# EasyEDA schematic 500V50A三相全桥板.json
TITLE: Sheet_1; REV: 1.0; Date: 2026-07-11; Sheet: 1/1; Drawn By: siberia-09; Company: Your Company
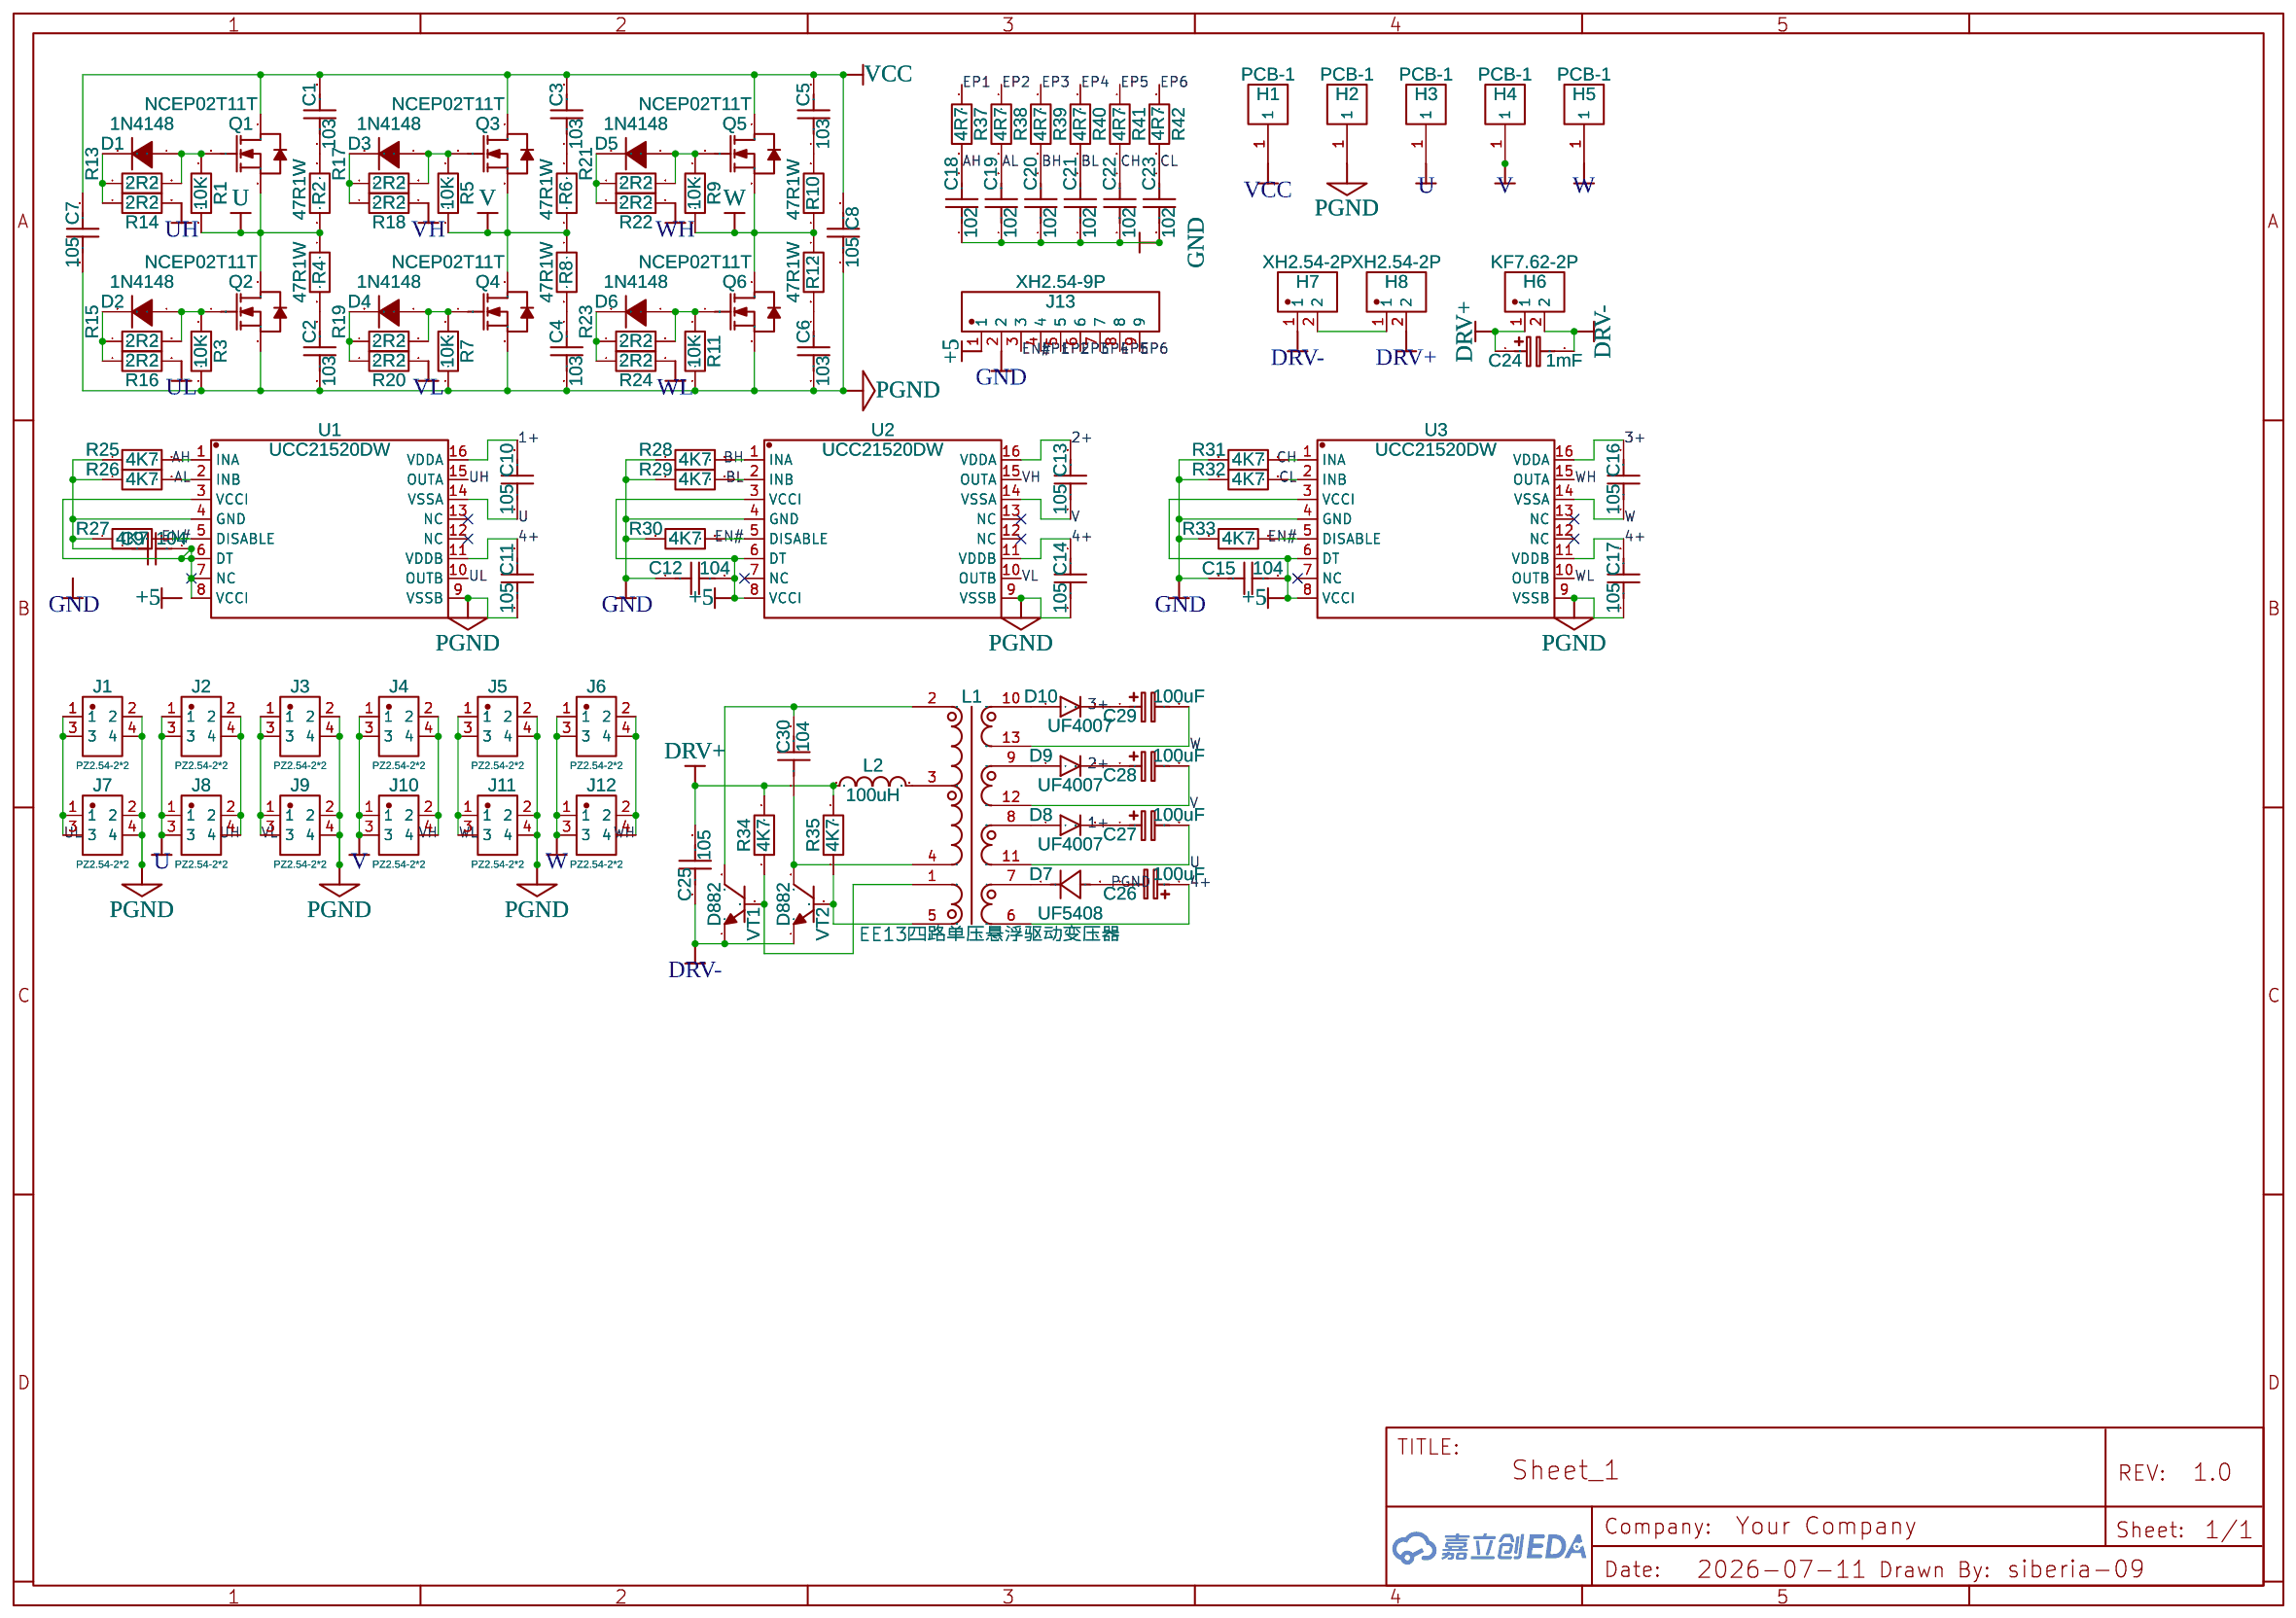
[diagram p0: schematic sheet]

## Parts
C1  103  [RAD-0.3]
C2  103  [RAD-0.3]
C3  103  [RAD-0.3]
C4  103  [RAD-0.3]
C5  103  [RAD-0.3]
C6  103  [RAD-0.3]
C7  105  [26*8 MKP]
C8  105  [26*8 MKP]
C9  104  [RAD-0.2]
C10  105  [RAD-0.2]
C11  105  [RAD-0.2]
C12  104  [RAD-0.2]
C13  105  [RAD-0.2]
C14  105  [RAD-0.2]
C15  104  [RAD-0.2]
C16  105  [RAD-0.2]
C17  105  [RAD-0.2]
C18  102  [RAD-0.2]
C19  102  [RAD-0.2]
C20  102  [RAD-0.2]
C21  102  [RAD-0.2]
C22  102  [RAD-0.2]
C23  102  [RAD-0.2]
C24  1mF  [CAP-10*25-W-2]
C25  105  [RAD-0.2]
C26  100uF  [CAP-6.3*11]
C27  100uF  [CAP-6.3*11]
C28  100uF  [CAP-6.3*11]
C29  100uF  [CAP-6.3*11]
C30  104  [RAD-0.2]
D1  1N4148  [SOD-323]
D2  1N4148  [SOD-323]
D3  1N4148  [SOD-323]
D4  1N4148  [SOD-323]
D5  1N4148  [SOD-323]
D6  1N4148  [SOD-323]
D7  UF5408  [DO-27]
D8  UF4007  [DO-41_BD2.4-L4.7-P8.70-D0.9-FD]
D9  UF4007  [DO-41_BD2.4-L4.7-P8.70-D0.9-FD]
D10  UF4007  [DO-41_BD2.4-L4.7-P8.70-D0.9-FD]
H1  PCB-1  [PCB-1 35A]
H2  PCB-1  [PCB-1 35A]
H3  PCB-1  [PCB-1 35A]
H4  PCB-1  [PCB-1 35A]
H5  PCB-1  [PCB-1 35A]
H6  KF7.62-2P  [CONN-TH_KF7.62-2P]
H7  XH2.54-2P  [CONN-TH_XH2.54-2P_1]
H8  XH2.54-2P  [CONN-TH_XH2.54-2P_1]
J1  PZ2.54-2*2  [HDR-TH_4P-P2.54-V-M-R2-C2-S2.54]
J2  PZ2.54-2*2  [HDR-TH_4P-P2.54-V-M-R2-C2-S2.54]
J3  PZ2.54-2*2  [HDR-TH_4P-P2.54-V-M-R2-C2-S2.54]
J4  PZ2.54-2*2  [HDR-TH_4P-P2.54-V-M-R2-C2-S2.54]
J5  PZ2.54-2*2  [HDR-TH_4P-P2.54-V-M-R2-C2-S2.54]
J6  PZ2.54-2*2  [HDR-TH_4P-P2.54-V-M-R2-C2-S2.54]
J7  PZ2.54-2*2  [HDR-TH_4P-P2.54-V-M-R2-C2-S2.54]
J8  PZ2.54-2*2  [HDR-TH_4P-P2.54-V-M-R2-C2-S2.54]
J9  PZ2.54-2*2  [HDR-TH_4P-P2.54-V-M-R2-C2-S2.54]
J10  PZ2.54-2*2  [HDR-TH_4P-P2.54-V-M-R2-C2-S2.54]
J11  PZ2.54-2*2  [HDR-TH_4P-P2.54-V-M-R2-C2-S2.54]
J12  PZ2.54-2*2  [HDR-TH_4P-P2.54-V-M-R2-C2-S2.54]
J13  XH2.54-9P  [CONN-TH_9P-P2.50_BX-XH2.54-9PZZ]
L1  EE13四路单压悬浮驱动变压器  [EE13单压四路悬浮驱动变压器]
L2  100uH  [L 15*7MM]
Q1  NCEP02T11T  [TO-247-3_L15.5-W5.0-P5.08-L]
Q2  NCEP02T11T  [TO-247-3_L15.5-W5.0-P5.08-L]
Q3  NCEP02T11T  [TO-247-3_L15.5-W5.0-P5.08-L]
Q4  NCEP02T11T  [TO-247-3_L15.5-W5.0-P5.08-L]
Q5  NCEP02T11T  [TO-247-3_L15.5-W5.0-P5.08-L]
Q6  NCEP02T11T  [TO-247-3_L15.5-W5.0-P5.08-L]
R1  10K  [R_AXIAL-0.4]
R2  47R1W  [R_AXIAL-0.4]
R3  10K  [R_AXIAL-0.4]
R4  47R1W  [R_AXIAL-0.4]
R5  10K  [R_AXIAL-0.4]
R6  47R1W  [R_AXIAL-0.4]
R7  10K  [R_AXIAL-0.4]
R8  47R1W  [R_AXIAL-0.4]
R9  10K  [R_AXIAL-0.4]
R10  47R1W  [R_AXIAL-0.4]
R11  10K  [R_AXIAL-0.4]
R12  47R1W  [R_AXIAL-0.4]
R13  2R2  [0805]
R14  2R2  [0805]
R15  2R2  [0805]
R16  2R2  [0805]
R17  2R2  [0805]
R18  2R2  [0805]
R19  2R2  [0805]
R20  2R2  [0805]
R21  2R2  [0805]
R22  2R2  [0805]
R23  2R2  [0805]
R24  2R2  [0805]
R25  4K7  [R_AXIAL-0.4]
R26  4K7  [R_AXIAL-0.4]
R27  4K7  [R VERTICAL 1/4W]
R28  4K7  [R_AXIAL-0.4]
R29  4K7  [R_AXIAL-0.4]
R30  4K7  [R VERTICAL 1/4W]
R31  4K7  [R_AXIAL-0.4]
R32  4K7  [R_AXIAL-0.4]
R33  4K7  [R VERTICAL 1/4W]
R34  4K7  [R VERTICAL 1/4W]
R35  4K7  [R VERTICAL 1/4W]
R37  4R7  [R VERTICAL 1/4W]
R38  4R7  [R VERTICAL 1/4W]
R39  4R7  [R VERTICAL 1/4W]
R40  4R7  [R VERTICAL 1/4W]
R41  4R7  [R VERTICAL 1/4W]
R42  4R7  [R VERTICAL 1/4W]
U1  UCC21520DW  [SOIC-16_L10.3-W7.5-P1.27-LS10.3-BL]
U2  UCC21520DW  [SOIC-16_L10.3-W7.5-P1.27-LS10.3-BL]
U3  UCC21520DW  [SOIC-16_L10.3-W7.5-P1.27-LS10.3-BL]
VT1  D882  [TO-126P-3_L7.5-W2.6-P2.29-L-A]
VT2  D882  [TO-126P-3_L7.5-W2.6-P2.29-L-A]

## Library data of the parts
C1-C23 C25 C30 = C_RAD-0.3_US: Contributor: LCEDA_Lib
C24 C26-C29 = C_Tan_SMD_A_EU: Contributor: LCEDA_Lib
D1-D6 = 1N4148: Supplier: LCSC; Manufacturer: ST(先科); Supplier Part: C14516; JLCPCB Part Class: Extended Part
D7 = UF5408_C2903841: Contributor: lcsc; Supplier: LCSC; Supplier Part: C2903841; Manufacturer: LGE(鲁光); JLCPCB Part Class: Extended Part
D8-D10 = UF4007_C84067: Contributor: 立创EDA官方封装库; Supplier: LCSC; Manufacturer: 星海; Supplier Part: C84067; JLCPCB Part Class: Extended Part
H1-H5 = PCB-5M5-100A: Contributor: SuperWoo
H6 = KF7.62-2P: Contributor: LCSC; Supplier: LCSC; Supplier Part: C707824; Manufacturer: KEFA(科发); JLCPCB Part Class: Extended Part
H7 H8 = WAFER-XH2.54-2PZZ: Contributor: lcsc; Supplier: LCSC; Supplier Part: C5359631; Manufacturer: XUNPU(讯普); JLCPCB Part Class: Extended Part
J1-J12 = PZ2.54-2*2: Contributor: lcsc; Supplier: LCSC; Supplier Part: C5156675; Manufacturer: ZHOURI(洲日); JLCPCB Part Class: Extended Part
J13 = BX-XH2.54-9PZZ: Supplier: LCSC; Supplier Part: C18077840; Manufacturer: Bossie(博锡); Contributor: lcsc; JLCPCB Part Class: Extended Part
L1 = EE13四路单压悬浮驱动变压器: Contributor: siberia-09
L2 = L0603_US: Contributor: LCEDA_Lib
Q1-Q6 = IRFP260N: Supplier: LCSC; Supplier Part: C33129608; Manufacturer: minos(迈诺斯); Contributor: lcsc; JLCPCB Part Class: Extended Part
R1-R12 R34 R35 R37-R42 = R_AXIAL-0.3_EU: Contributor: LCEDA_Lib
R13-R33 = R_AXIAL-0.4_EU: Contributor: LCEDA_Lib
U1-U3 = UCC21520DW: Contributor: LCSC; Supplier: LCSC; Supplier Part: C200361; Manufacturer: TI(德州仪器); JLCPCB Part Class: Extended Part
VT1 VT2 = D882P: Supplier: LCSC; Supplier Part: C9900159908; Manufacturer: null; Contributor: lcsc

## Nets
GND: C12.1 C15.1 C18.1 C19.1 C20.1 C21.1 C22.2 C23.2 J13.2 R28.1 R29.1 R30.1 R31.1 R32.1 R33.1 U2.4(GND) U3.4(GND)
PGND: C2.2 C4.2 C6.2 C7.1 C8.1 C11.1 C14.1 C17.1 C26.2 D7.2(A) H2.1 J1.2 J1.4 J3.2 J3.4 J5.2 J5.4 J7.2 J7.4 J9.2 J9.4 J11.2 J11.4 Q2.3(S) Q4.3(S) Q6.3(S) R3.1 R7.1 R11.1 U1.9(VSSB) U2.9(VSSB) U3.9(VSSB)
VCC: C1.2 C3.2 C5.2 C7.2 C8.2 H1.1 Q1.2(D) Q3.2(D) Q5.2(D)
1+: C10.2 C27.1 D8.2(C) U1.16(VDDA)
2+: C13.2 C28.1 D9.2(C) U2.16(VDDA)
3+: C16.2 C29.1 D10.2(C) U3.16(VDDA)
4+: C11.2 C14.2 C17.2 C26.1 L1.6 U1.11(VDDB) U2.11(VDDB) U3.11(VDDB)
+5: C12.2 C15.2 J13.1 U2.3(VCCI) U2.6(DT) U2.8(VCCI) U3.3(VCCI) U3.6(DT) U3.8(VCCI)
AH: C18.2 R25.2 R37.2 U1.1(INA)
AL: C19.2 R26.2 R38.2 U1.2(INB)
BH: C20.2 R28.2 R39.2 U2.1(INA)
BL: C21.2 R29.2 R40.2 U2.2(INB)
CH: C22.1 R31.2 R41.2 U3.1(INA)
CL: C23.1 R32.2 R42.2 U3.2(INB)
DRV+: C24.1 C25.2 H6.1 H8.2 L2.1 R34.2 R35.2
DRV-: C24.2 C25.1 H6.2 H7.1 VT1.1(E) VT2.1(E)
EN#: J13.3 R27.2 R30.2 R33.2 U1.5(DISABLE) U2.5(DISABLE) U3.5(DISABLE)
EP1: J13.4 R37.1
EP2: J13.5 R38.1
EP3: J13.6 R39.1
EP4: J13.7 R40.1
EP5: J13.8 R41.1
EP6: J13.9 R42.1
U: C10.1 C27.2 H3.1 J2.1 J2.3 J8.1 J8.3 L1.11 Q1.3(S) Q2.2(D) R1.1 R2.1 R4.1 U1.14(VSSA)
UH: J2.2 J2.4 J8.2 J8.4 R14.2 U1.15(OUTA)
UL: J1.1 J1.3 J7.1 J7.3 R16.2 U1.10(OUTB)
V: C13.1 C28.2 H4.1 J4.1 J4.3 J10.1 J10.3 L1.12 Q3.3(S) Q4.2(D) R5.1 R6.1 R8.1 U2.14(VSSA)
VH: J4.2 J4.4 J10.2 J10.4 R18.2 U2.15(OUTA)
VL: J3.1 J3.3 J9.1 J9.3 R20.2 U2.10(OUTB)
W: C16.1 C29.2 H5.1 J6.1 J6.3 J12.1 J12.3 L1.13 Q5.3(S) Q6.2(D) R9.1 R10.1 R12.1 U3.14(VSSA)
WH: J6.2 J6.4 J12.2 J12.4 R22.2 U3.15(OUTA)
WL: J5.1 J5.3 J11.1 J11.3 R24.2 U3.10(OUTB)
Net-(C1-1): C1.1 R2.2
Net-(C2-1): C2.1 R4.2
Net-(C3-1): C3.1 R6.2
Net-(C4-1): C4.1 R8.2
Net-(C5-1): C5.1 R10.2
Net-(C6-1): C6.1 R12.2
Net-(C9-1): C9.1 R25.1 R26.1 R27.1 U1.4(GND)
Net-(C9-2): C9.2 U1.3(VCCI) U1.6(DT) U1.7(NC) U1.8(VCCI)
Net-(C30-1): C30.1 L1.4 VT2.2(C)
Net-(C30-2): C30.2 L1.2 VT1.2(C)
Net-(D1-1): D1.1(A) Q1.1(G) R1.2 R13.2
Net-(D1-2): D1.2(C) R13.1 R14.1
Net-(D2-1): D2.1(A) Q2.1(G) R3.2 R15.2
Net-(D2-2): D2.2(C) R15.1 R16.1
Net-(D3-1): D3.1(A) Q3.1(G) R5.2 R17.2
Net-(D3-2): D3.2(C) R17.1 R18.1
Net-(D4-1): D4.1(A) Q4.1(G) R7.2 R19.2
Net-(D4-2): D4.2(C) R19.1 R20.1
Net-(D5-1): D5.1(A) Q5.1(G) R9.2 R21.2
Net-(D5-2): D5.2(C) R21.1 R22.1
Net-(D6-1): D6.1(A) Q6.1(G) R11.2 R23.2
Net-(D6-2): D6.2(C) R23.1 R24.1
Net-(D7-1): D7.1(K) L1.7
Net-(D8-1): D8.1(A) L1.8
Net-(D9-1): D9.1(A) L1.9
Net-(D10-1): D10.1(A) L1.10
Net-(H7-2): H7.2 H8.1
Net-(L1-1): L1.1 R34.1 VT1.3(B)
Net-(L1-3): L1.3 L2.2
Net-(L1-5): L1.5 R35.1 VT2.3(B)

Not connected (* = marked no-connect by the designer): U1 12(NC)* 13(NC)*; U2 7(NC)* 12(NC)* 13(NC)*; U3 7(NC)* 12(NC)* 13(NC)*
